# EAGLE design current-sense (EAGLE 8.2.1)
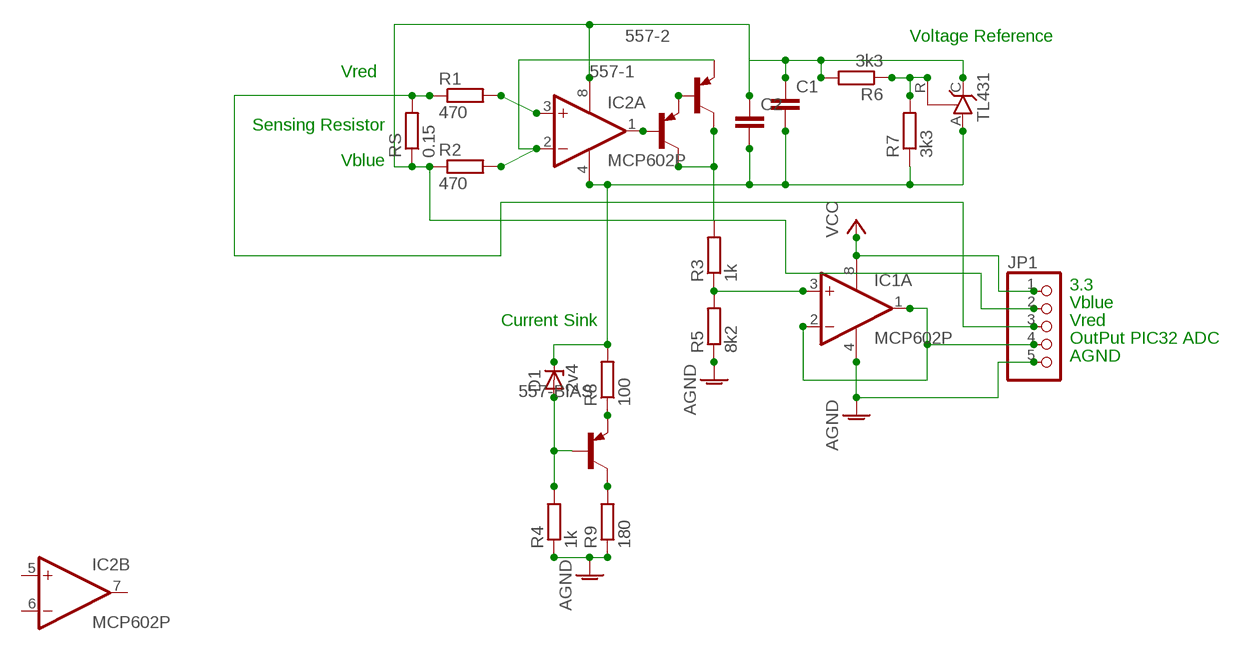
[diagram p0: schematic, sheet 1]

## Parts
557-1  BC557A-PNP-TO92-EBC  [TO92-EBC]
557-2  BC557A-PNP-TO92-EBC  [TO92-EBC]
557-BIAS  BC557A-PNP-TO92-EBC  [TO92-EBC]
C1  C-EU075-032X103  [C075-032X103]
C2  C-EU075-032X103  [C075-032X103]
D1  2v4  ZENER-DIODEZD-7.5  [ZDIO-7.5]
IC1  MCP602P  [DIL08]
IC2  MCP602P  [DIL08]
JP1  PINHD-1X5  [1X05]
R1  470  R-EU_0204/7  [0204/7]
R2  470  R-EU_0204/7  [0204/7]
R3  1k  R-EU_0204/7  [0204/7]
R4  1k  R-EU_0204/7  [0204/7]
R5  8k2  R-EU_0204/7  [0204/7]
R6  3k3  R-EU_0204/7  [0204/7]
R7  3k3  R-EU_0204/7  [0204/7]
R8  100  R-EU_0204/7  [0204/7]
R9  180  R-EU_0204/7  [0204/7]
RS  0.15  R-EU_VTA55  [VTA55]
TL431  TL431CLP  [TO92-CLP]

## Nets
AGND: IC1.4(P:V-) JP1.5 R5.1
N$1: C1.2 C2.2 D1.C IC2.4(P:V-) R7.1 R8.2 TL431.A
N$2: IC2.3(A:+IN) R1.2
N$3: 557-1.B IC2.1(A:OUT)
N$4: 557-2.E IC2.2(A:-IN) R2.2
N$6: 557-1.E 557-2.B
N$9: IC1.3(A:+IN) R3.1 R5.2
N$10: 557-1.C 557-2.C R3.2
N$11: 557-BIAS.E R8.1
N$12: R6.1 R7.2 TL431.R
N$13: 557-BIAS.C R9.2
N$14: 557-BIAS.B D1.A R4.2
N$15: R4.1 R9.1 ; supply symbol labelled AGND
OUT: IC1.1(A:OUT) IC1.2(A:-IN) JP1.4
SN: C1.1 C2.1 IC2.8(P:V+) JP1.2 R2.1 R6.2 RS.1 TL431.C
SP: JP1.3 R1.1 RS.2
VCC: IC1.8(P:V+) JP1.1
Unconnected: IC1.5(B:+IN) IC1.6(B:-IN) IC1.7(B:OUT) IC2.5(B:+IN) IC2.6(B:-IN) IC2.7(B:OUT)

## Notes on the sheet
- Voltage Reference
- Vred
- Sensing Resistor
- Vblue
- 3.3
- Vblue
- Current Sink | Vred
- OutPut PIC32 ADC
- AGND

## Library data of the parts
557-1 557-2 557-BIAS = transistor:*-PNP-: PNP Transistror
C1 C2 = rcl:C-EU: CAPACITOR, European symbol
D1 = diode:ZENER-DIODE: Z-Diode
IC1 IC2 = linear:MCP602: Single Op Amp 2.7V to 6.0V Single Supply CMOS Source: http://ww1.microchip.com/downloads/en/DeviceDoc/21314g.pdf
JP1 = pinhead:PINHD-1X5: PIN HEADER
R1-R9 = resistor:R-EU_: RESISTOR, European symbol
RS = rcl:R-EU_: RESISTOR, European symbol
TL431 = v-reg:TL431CLP: VOLTAGE REGULATOR

## Board
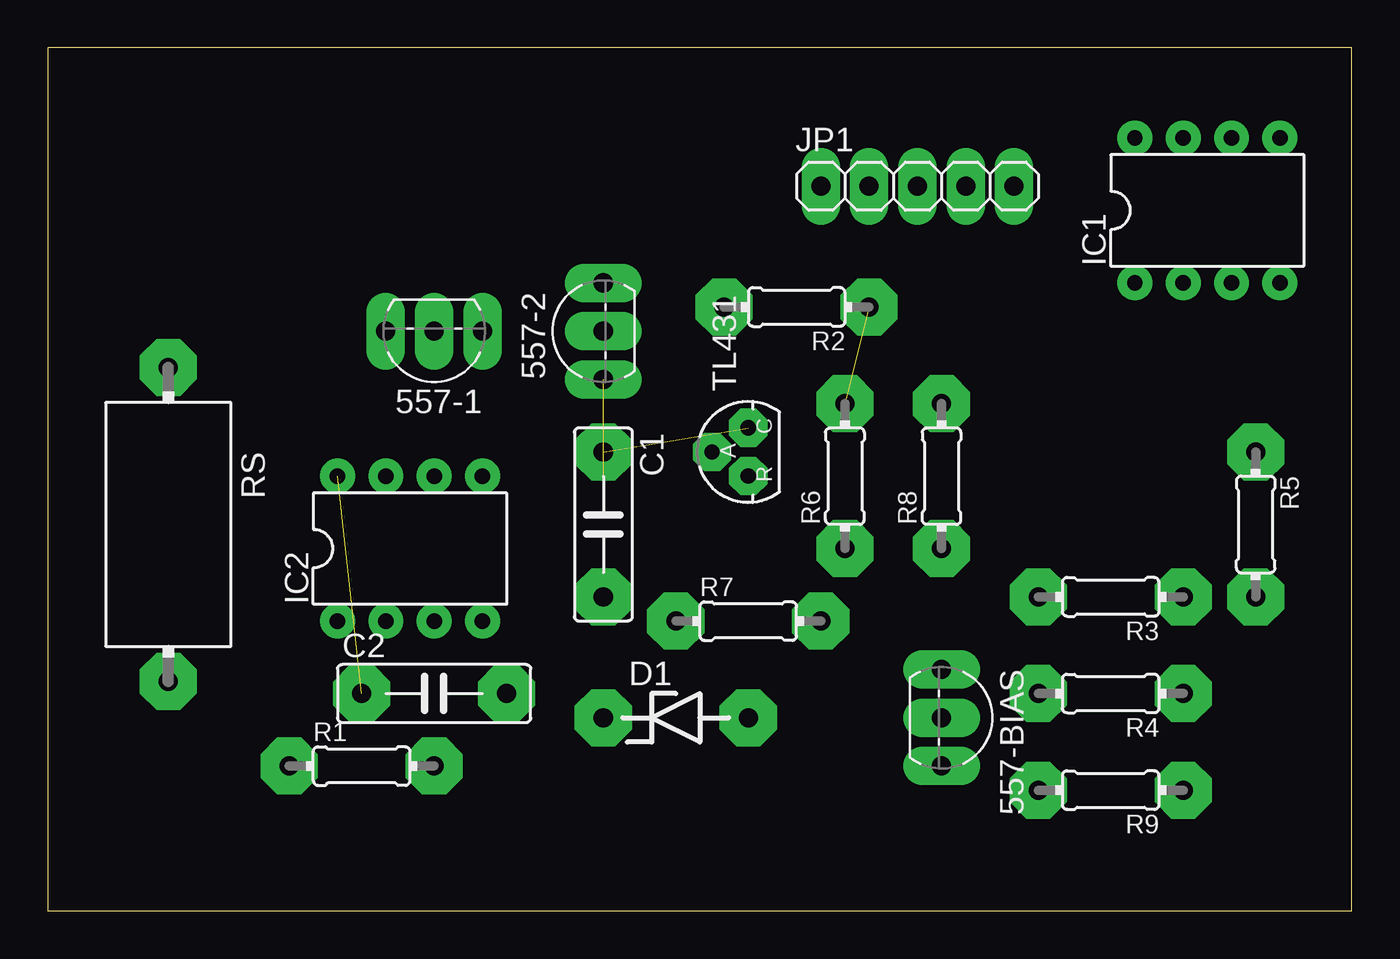
[diagram p1: board, top side]
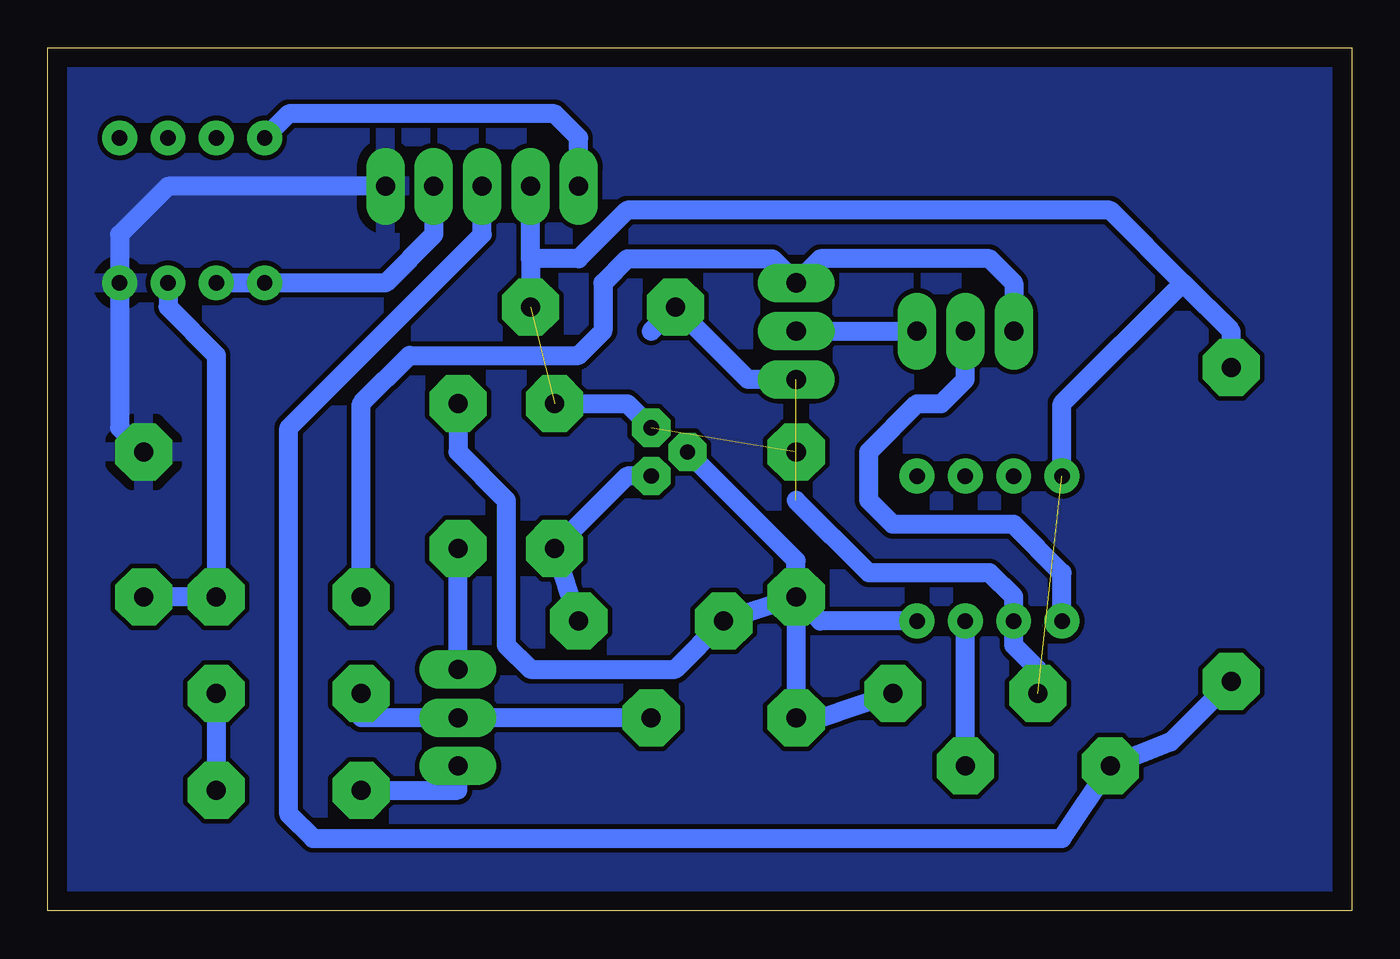
[diagram p2: board, bottom side, seen from below]

Size 68.56 x 45.39 mm. Coordinates in mm from the lower left corner, seen from the top.
Outline: 0,0 68.56,0 68.56,45.39 0,45.39 0,0
Copper layers (1*16): Top 0.035mm / dielectric 1.5mm / Bottom 0.035mm
Design rules "default *": minimum track width 10mil, minimum drill 0.8mm, track to track 0.25mm, track to pad 0.25mm, pad to pad 0.25mm, via to via 0.25mm, smd to smd 0.25mm, copper to edge 40mil, drill to drill 8mil, minimum pad ring 8mil, minimum via ring 8mil, stop-mask expansion 4mil, vias tented up to drill 0mil, thermal gap 20mil

### Footprints (pad centres in the part's own frame; a part is rotated, then mirrored left to right if it is on the bottom)
TO92-EBC = drill 1 pad 2 long: B 0,-1.27; C 2.54,-1.27; E -2.54,-1.27
C075-032X103 = drill 1 pad 3 octagon: 1 -3.81,0; 2 3.81,0
ZDIO-7.5 = drill 1 pad 3 octagon: A 3.81,0; C -3.81,0
DIL08 = drill 0.813 pad 1.27: 1 -3.81,-3.81; 2 -1.27,-3.81; 3 1.27,-3.81; 4 3.81,-3.81; 5 3.81,3.81; 6 1.27,3.81; 7 -1.27,3.81; 8 -3.81,3.81
1X05 = drill 1 pad 2 long: 1 -5.08,0; 2 -2.54,0; 3 0,0; 4 2.54,0; 5 5.08,0
0204/7 = drill 1 pad 3 octagon: 1 -3.81,0; 2 3.81,0
VTA55 = drill 1 pad 3 octagon: 1 -8.255,0; 2 8.255,0
TO92-CLP = drill 0.8 pad 2 octagon: A 0,1.905; C 1.27,0; R -1.27,0

### Placement (x,y rotation side)
557-1  20.32,29.21 180 top
557-2  27.94,30.48 90 top
557-BIAS  48.26,10.16 270 top
C1  29.21,20.32 270 top
C2  20.32,11.43 0 top
D1  33.02,10.16 0 top
IC1  60.96,36.83 0 top
IC2  19.05,19.05 0 top
JP1  45.72,38.1 0 top
R1  16.51,7.62 0 top
R2  39.37,31.75 180 top
R3  55.88,16.51 180 top
R4  55.88,11.43 180 top
R5  63.5,20.32 270 top
R6  41.91,22.86 90 top
R7  36.83,15.24 0 top
R8  46.99,22.86 90 top
R9  55.88,6.35 180 top
RS  6.35,20.32 270 top
TL431  36.83,24.13 90 top

### Tracks (layer width: path | path; a pad name or v marks a point on that pad's centre or on a via)
AGND
  Bottom 1: R5.1 64.77,25.4 IC1.4 64.77,35.56 62.23,38.1 JP1.5
  pour Bottom: 0,44.45 68.58,44.45 68.58,0 0,1.27
N$1
  Bottom 1: C1.2 R7.1 35.56,12.7 43.18,12.7 44.45,13.97 44.45,21.59 46.99,24.13 R8.2 | C1.2 29.21,18.41 TL431.A | IC2.4 27.94,15.24 C1.2 | C1.2 D1.C 27.94,10.16 C2.2
N$2
  Bottom 1: R1.2 IC2.3
N$3
  Bottom 1: IC2.1 15.24,17.78 17.78,20.32 24.13,20.32 25.4,21.59 25.4,24.13 22.86,26.67 21.59,26.67 20.32,27.94 557-1.B
N$4  (1 unrouted)
  Bottom 1: 557-2.E 31.75,27.94 R2.2 36.83,30.48 | 16.51,12.7 17.78,13.97 IC2.2 17.78,16.51 19.05,17.78 25.4,17.78 29.21,21.59
N$6
  Bottom 1: 557-2.B 557-1.E
N$9
  Bottom 1: R5.2 R3.1 59.69,29.21 62.23,31.75 IC1.3
N$10
  Bottom 1: 557-1.C 17.78,33.02 19.05,34.29 27.94,34.29 557-2.C 30.48,34.29 38.1,34.29 39.37,33.02 39.37,30.48 40.64,29.21 49.53,29.21 52.07,26.67 R3.2
N$11
  Bottom 1: 557-BIAS.E R8.1
N$12
  Bottom 1: TL431.R 38.1,22.86 R6.1 R7.2
N$13
  Bottom 1: R9.2 46.99,6.35 557-BIAS.C
N$14
  Bottom 1: D1.A 557-BIAS.B 52.07,10.16 R4.2
N$15
  Bottom 1: R4.1 R9.1
OUT
  Bottom 1: JP1.4 48.26,35.56 50.8,33.02 IC1.1 IC1.2
SN  (3 unrouted)
  Bottom 1: 43.18,34.29 JP1.2 | 43.18,34.29 R2.1 | RS.1 6.35,30.48 8.89,33.02 | 8.89,33.02 12.7,36.83 38.1,36.83 40.64,34.29 43.18,34.29 | IC2.8 15.24,26.67 8.89,33.02 | R6.2 38.1,26.67 TL431.C
SP
  Bottom 1: RS.2 9.53,8.89 R1.1 15.24,3.81 54.61,3.81 55.88,5.08 55.88,25.4 45.72,35.56 JP1.3
VCC
  Bottom 1: JP1.1 40.64,40.64 41.91,41.91 55.88,41.91 IC1.8